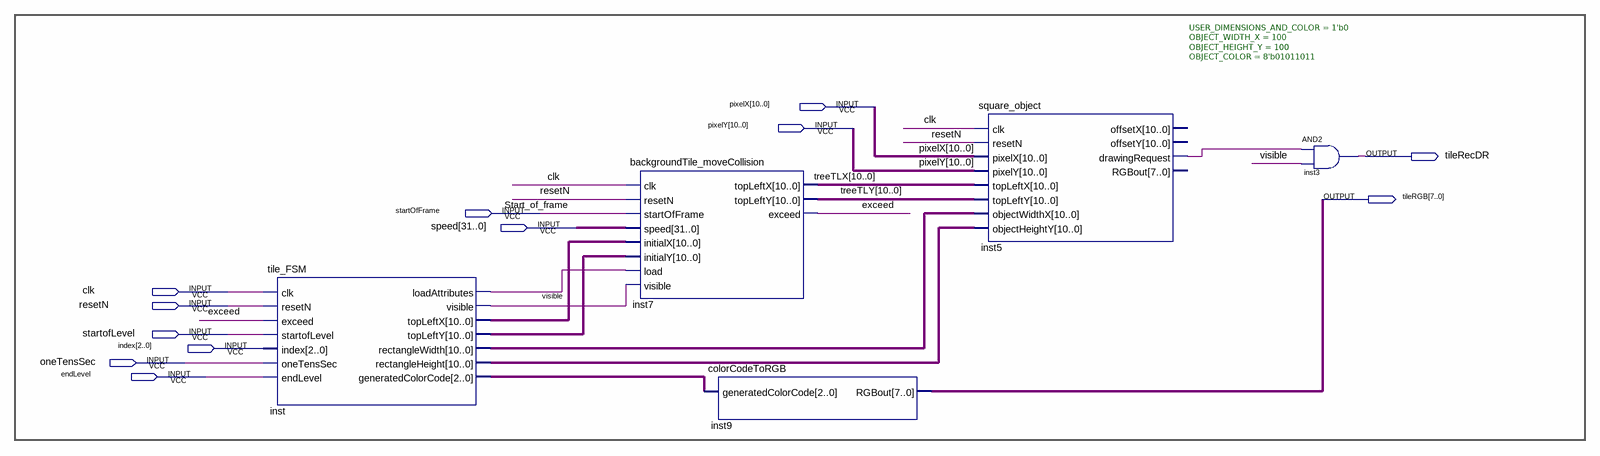
[diagram p0: schematic sheet]
// Quartus schematic TILE_TOP.bdf as structural Verilog: 5 symbols, 12 pins
module TILE_TOP (
  input  [10:0] pixelX,
  input  [10:0] pixelY,
  input  startOfFrame,
  input  [31:0] speed,
  input  clk,
  input  resetN,
  input  startofLevel,
  input  [2:0] index,
  input  oneTensSec,
  input  endLevel,
  output tileRecDR,
  output [7:0] tileRGB
);

  wire exceed, inst5_drawingrequest, inst_loadattributes, visible;
  wire [2:0] inst_generatedcolorcode;
  wire [10:0] inst_rectangleheight, inst_rectanglewidth, inst_topleftx, inst_toplefty, treeTLX, treeTLY;

  tile_FSM inst (
    .clk(clk), .resetN(resetN), .exceed(exceed), .startofLevel(startofLevel), .index(index),
    .oneTensSec(oneTensSec), .endLevel(endLevel), .loadAttributes(inst_loadattributes), .visible(visible),
    .topLeftX(inst_topleftx), .topLeftY(inst_toplefty), .rectangleWidth(inst_rectanglewidth),
    .rectangleHeight(inst_rectangleheight), .generatedColorCode(inst_generatedcolorcode));
  backgroundTile_moveCollision inst7 (
    .clk(clk), .resetN(resetN), .startOfFrame(startOfFrame), .speed(speed), .initialX(inst_topleftx),
    .initialY(inst_toplefty), .load(inst_loadattributes), .visible(visible), .topLeftX(treeTLX),
    .topLeftY(treeTLY), .exceed(exceed));
  colorCodeToRGB inst9 (.generatedColorCode(inst_generatedcolorcode), .RGBout(tileRGB));
  square_object #(.USER_DIMENSIONS_AND_COLOR(1'b0), .OBJECT_WIDTH_X(100), .OBJECT_HEIGHT_Y(100), .OBJECT_COLOR(8'b01011011)) inst5 (
    .clk(clk), .resetN(resetN), .pixelX(pixelX), .pixelY(pixelY), .topLeftX(treeTLX), .topLeftY(treeTLY),
    .objectWidthX(inst_rectanglewidth), .objectHeightY(inst_rectangleheight),
    .drawingRequest(inst5_drawingrequest));  // open: offsetX, offsetY, RGBout
  and inst3 (tileRecDR, inst5_drawingrequest, visible);

  // Other names for the same wires on the sheet: Start_of_frame = startOfFrame
endmodule
